# EAGLE design usbtinyisp (EAGLE 7.7.0)
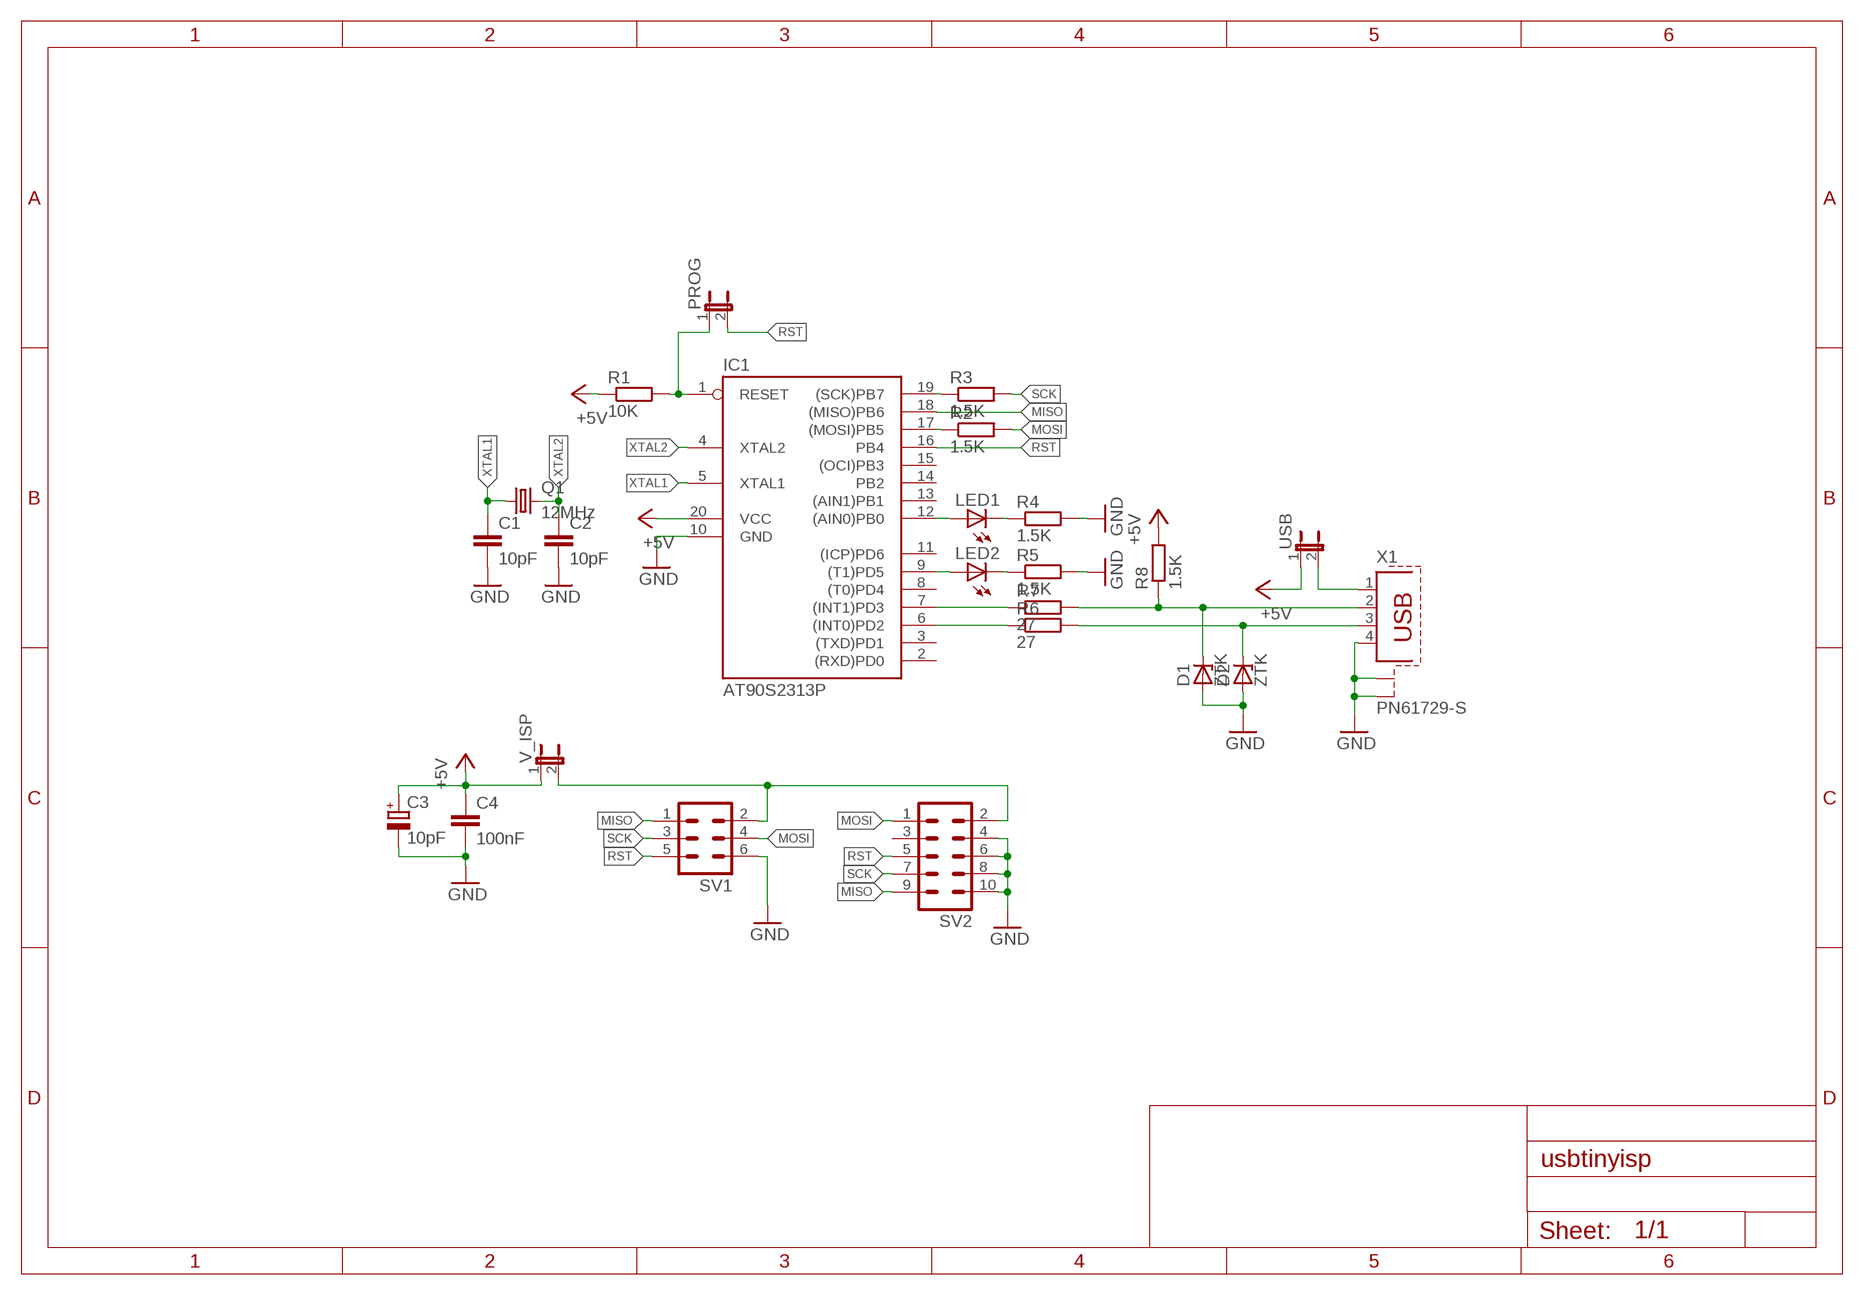
[diagram p0: schematic, sheet 1]

## Parts
C1  10pF  C-EU025-025X050  [C025-025X050]
C2  10pF  C-EU025-025X050  [C025-025X050]
C3  10pF  CPOL-EUE2,5-6E  [E2,5-6E]
C4  100nF  C-EU025-025X050  [C025-025X050]
D1  ZTK  [DO35Z10]
D2  ZTK  [DO35Z10]
IC1  AT90S2313P  [DIL20]
LED1  LED3MM  [LED3MM]
LED2  LED3MM  [LED3MM]
PROG  JP1E  [JP1]
Q1  12MHz  CRYSTALHC49U70  [HC49U70]
R1  10K  R-EU_0207/7  [0207/7]
R2  1.5K  R-EU_0207/7  [0207/7]
R3  1.5K  R-EU_0207/7  [0207/7]
R4  1.5K  R-EU_0207/7  [0207/7]
R5  1.5K  R-EU_0207/7  [0207/7]
R6  27  R-EU_0207/7  [0207/7]
R7  27  R-EU_0207/7  [0207/7]
R8  1.5K  R-EU_0207/7  [0207/7]
SV1  MA03-2  [MA03-2]
SV2  MA05-2  [MA05-2]
USB  JP1E  [JP1]
V_ISP  JP1E  [JP1]
X1  PN61729-S  [PN61729-S]

## Nets
+5V: C3.+ C4.1 IC1.20(VCC) R1.1 R8.2 USB.1 V_ISP.1
GND: C1.2 C2.2 C3.- C4.2 D1.A D2.A IC1.10(GND) R4.2 R5.2 SV1.6 SV2.4 SV2.6 SV2.8 SV2.10 X1.4 X1.S1 X1.S2
MISO: IC1.18((MISO)PB6) SV1.1 SV2.9
MOSI: R2.2 SV1.4 SV2.1
N$1: IC1.1(RESET) PROG.1 R1.2
N$2: IC1.12((AIN0)PB0) LED1.A
N$3: IC1.9((T1)PD5) LED2.A
N$4: LED1.K(C) R4.1
N$5: LED2.K(C) R5.1
N$6: IC1.7((INT1)PD3) R7.1
N$7: IC1.17((MOSI)PB5) R2.1
N$8: IC1.19((SCK)PB7) R3.1
N$9: IC1.6((INT0)PD2) R6.1
N$10: D2.C R6.2 X1.3
N$11: D1.C R7.2 R8.1 X1.2
N$13: USB.2 X1.1
N$14: SV1.2 SV2.2 V_ISP.2
RST: IC1.16(PB4) PROG.2 SV1.5 SV2.5
SCK: R3.2 SV1.3 SV2.7
XTAL1: C1.1 IC1.5(XTAL1) Q1.1
XTAL2: C2.1 IC1.4(XTAL2) Q1.2
Unconnected: IC1.2((RXD)PD0) IC1.3((TXD)PD1) IC1.8((T0)PD4) IC1.11((ICP)PD6) IC1.13((AIN1)PB1) IC1.14(PB2) IC1.15((OCI)PB3) SV2.3

## Library data of the parts
C1 C2 C4 = rcl:C-EU: CAPACITOR, European symbol
C3 = rcl:CPOL-EU: POLARIZED CAPACITOR, European symbol
D1 D2 = diode:ZTK: Z DIODE
IC1 = avr-5:AT90S2313: MICROCONTROLLER 2 Kbytes FLASH 128 bytes SRAM 128 bytes EEPROM UART
LED1 LED2 = led:LED: LED OSRAM: - CHIPLED LG R971, LG N971, LY N971, LG Q971, LY Q971, LO R971, LY R971 LH N974, LH R974 LS Q976, LO Q976, LY Q976 LO Q996 - Hyper CHIPLED LW Q18S LB Q993, LB Q99A, LB R99A - SideLED LS A670, LO A670, LY A670, LG A670, LP A670 LB A673, LV A673, LT A673, LW A673 LH A674 LY A675 LS A676, LA A676, LO A676, LY A676, LW A676 LS A679, LY A679, LG A679 - Hyper Micro SIDELED® LS Y876, LA Y876, LO Y876, LY Y876 LT Y87S - SmartLED LW L88C, LW L88S LB L89C, LB L89S, LG L890 LS L89K, LO L89K, LY L89K LS L896, LA L896, LO L896, LY L896 - TOPLED LS T670, LO T670, LY T670, LG T670, LP T670 LSG T670, LSP T670, LSY T670, LOP T670, LYG T670 LG T671, LOG T671, LSG T671 LB T673, LV T673, LT T673, LW T673 LH T674 LS T676, LA T676, LO T676, LY T676, LB T676, LH T676, LSB T676, LW T676 LB T67C, LV T67C, LT T67C, LS T67K, LO T67K, LY T67K, LW E67C LS E67B, LA E67B, LO E67B, LY E67B, LB E67C, LV E67C, LT E67C LW T67C LS T679, LY T679, LG T679 LS T770, LO T770, LY T770, LG T770, LP T770 LB T773, LV T773, LT T773, LW T773 LH T774 LS E675, LA E675, LY E675, LS T675 LS T776, LA T776, LO T776, LY T776, LB T776 LHGB T686 LT T68C, LB T68C - Hyper Mini TOPLED® LB M676 - Mini TOPLED Santana® LG M470 LS M47K, LO M47K, LY M47K Source: http://www.osram.convergy.de LUXEON: - LUMILED® LXK2-PW12-R00, LXK2-PW12-S00, LXK2-PW14-U00, LXK2-PW14-V00 LXK2-PM12-R00, LXK2-PM12-S00, LXK2-PM14-U00 LXK2-PE12-Q00, LXK2-PE12-R00, LXK2-PE12-S00, LXK2-PE14-T00, LXK2-PE14-U00 LXK2-PB12-K00, LXK2-PB12-L00, LXK2-PB12-M00, LXK2-PB14-N00, LXK2-PB14-P00, LXK2-PB14-Q00 LXK2-PR12-L00, LXK2-PR12-M00, LXK2-PR14-Q00, LXK2-PR14-R00 LXK2-PD12-Q00, LXK2-PD12-R00, LXK2-PD12-S00 LXK2-PH12-R00, LXK2-PH12-S00 LXK2-PL12-P00, LXK2-PL12-Q00, LXK2-PL12-R00 Source: www.luxeon.com KINGBRIGHT: KA-3528ASYC Source: www.kingbright.com
PROG USB V_ISP = jumper:JP1E: JUMPER
Q1 = crystal:CRYSTAL: CRYSTAL; OC_FARNELL: unknown; OC_NEWARK: unknown
R1-R8 = rcl:R-EU_: RESISTOR, European symbol
SV1 = con-lstb:MA03-2: PIN HEADER; OC_FARNELL: unknown; OC_NEWARK: unknown
SV2 = con-lstb:MA05-2: PIN HEADER; OC_FARNELL: unknown; OC_NEWARK: unknown
X1 = con-berg:PN61729-S: BERG USB connector; OC_FARNELL: unknown; OC_NEWARK: unknown

## Board
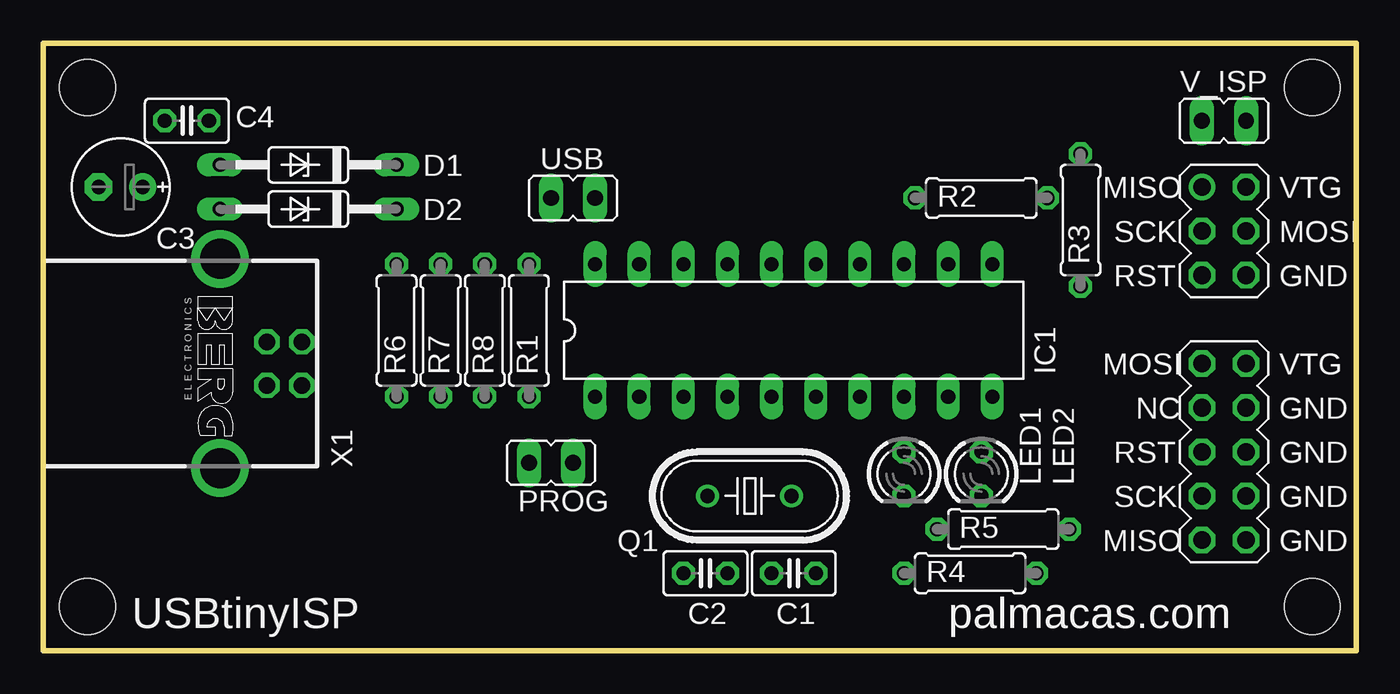
[diagram p1: board, top side]
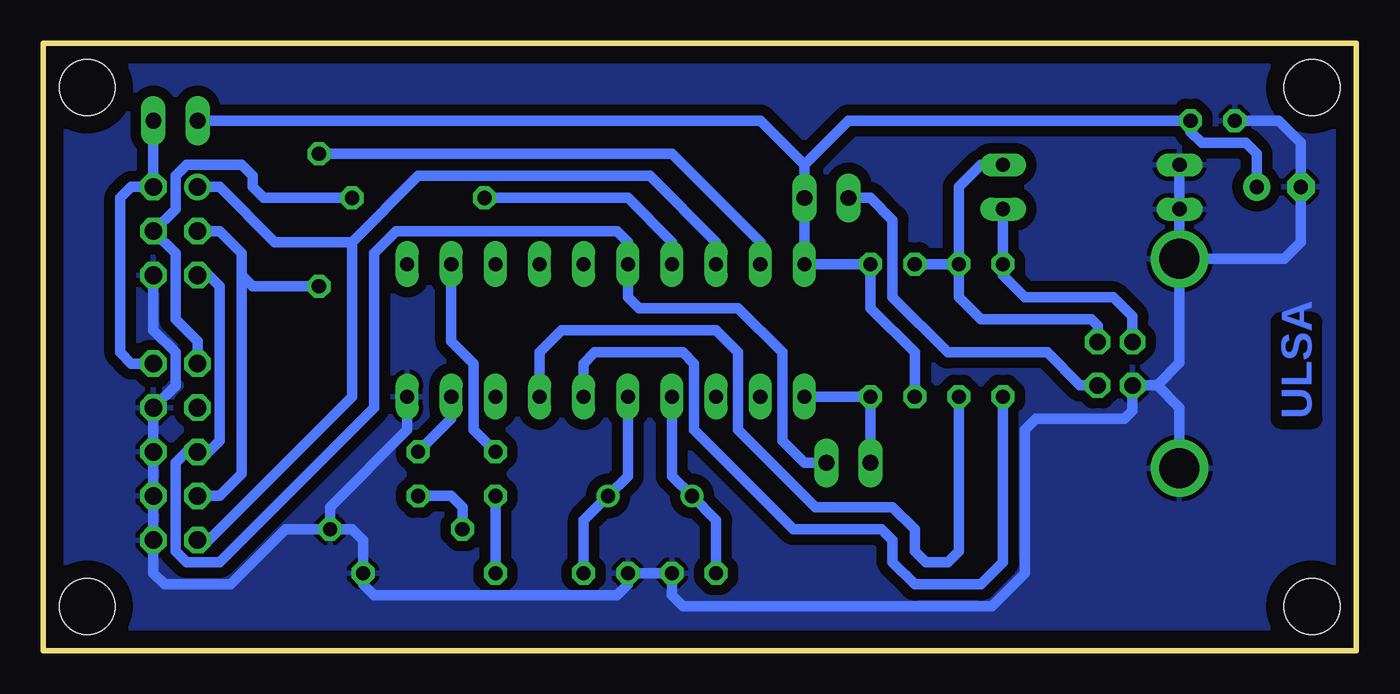
[diagram p2: board, bottom side, seen from below]

Size 75.55 x 34.92 mm. Coordinates in mm from the lower left corner, seen from the top.
Outline: 0,0 75.55,0 75.55,34.92 0,34.92 0,0
Copper layers (1*16): Top 0.035mm / dielectric 1.5mm / Bottom 0.035mm
Design rules "default": minimum track width 10mil, minimum drill 24mil, track to track 8mil, track to pad 8mil, pad to pad 8mil, via to via 8mil, smd to smd 8mil, copper to edge 40mil, drill to drill 8mil, minimum pad ring 10mil, minimum via ring 8mil, stop-mask expansion 4mil, vias tented up to drill 0mil, thermal gap 10mil
Holes 3.2 mm at 2.54,32.38 73.03,32.38 73.03,2.54 2.54,2.54

### Footprints (pad centres in the part's own frame; a part is rotated, then mirrored left to right if it is on the bottom)
C025-025X050 = drill 0.813 octagon: 1 -1.27,0; 2 1.27,0
E2,5-6E = drill 0.813 pad 1.575: + -1.27,0 | drill 0.813 pad 1.575 octagon: - 1.27,0
DO35Z10 = drill 0.813 long: A 5.08,0; C -5.08,0
DIL20 = drill 0.813 long: 1 -11.43,-3.81; 2 -8.89,-3.81; 3 -6.35,-3.81; 4 -3.81,-3.81; 5 -1.27,-3.81; 6 1.27,-3.81; 7 3.81,-3.81; 8 6.35,-3.81; 9 8.89,-3.81; 10 11.43,-3.81; 11 11.43,3.81; 12 8.89,3.81; 13 6.35,3.81; 14 3.81,3.81; 15 1.27,3.81; 16 -1.27,3.81; 17 -3.81,3.81; 18 -6.35,3.81; 19 -8.89,3.81; 20 -11.43,3.81
LED3MM = drill 0.813 octagon: A -1.27,0; K 1.27,0
JP1 = drill 0.914 long: 1 0,-1.27; 2 0,1.27
HC49U70 = drill 0.813: 1 -2.413,0; 2 2.413,0
0207/7 = drill 0.813 octagon: 1 -3.81,0; 2 3.81,0
MA03-2 = drill 1.016: 1 -2.54,-1.27 | drill 1.016 octagon: 2 -2.54,1.27; 3 0,-1.27; 4 0,1.27; 5 2.54,-1.27; 6 2.54,1.27
MA05-2 = drill 1.016 octagon: 1 -5.08,-1.27; 2 -5.08,1.27; 3 -2.54,-1.27; 4 -2.54,1.27; 5 0,-1.27; 6 0,1.27; 7 2.54,-1.27; 8 2.54,1.27; 9 5.08,-1.27; 10 5.08,1.27
PN61729-S = drill 0.95 octagon: 1 1.25,4.71; 2 -1.25,4.71; 3 -1.25,2.71; 4 1.25,2.71 | drill 2.3 pad 2.9: S1 -6.02,0; S2 6.02,0

### Placement (x,y rotation side)
C1  43.18,4.45 180 top
C2  38.1,4.45 0 top
C3  4.45,26.67 180 top
C4  8.26,30.48 180 top
D1  15.24,27.94 180 top
D2  15.24,25.4 180 top
IC1  43.18,18.41 0 top
LED1  49.53,10.16 270 top
LED2  53.98,10.16 270 top
PROG  29.21,10.79 270 top
Q1  40.64,8.89 180 top
R1  27.94,18.41 270 top
R2  53.98,26.04 0 top
R3  59.69,24.77 270 top
R4  53.34,4.45 0 top
R5  55.24,6.99 0 top
R6  20.32,18.41 90 top
R7  22.86,18.41 90 top
R8  25.4,18.41 270 top
SV1  67.94,24.13 270 top
SV2  67.94,11.43 270 top
USB  30.48,26.04 90 top
V_ISP  67.94,30.48 270 top
X1  10.16,16.51 270 top

### Tracks (layer width: path | path; a pad name or v marks a point on that pad's centre or on a via)
+5V
  Bottom 0.61: R8.2 25.4,17.14 27.94,19.68 R1.1 IC1.20 USB.1 31.75,27.94 | 31.75,27.94 29.21,30.48 C4.1 9.53,29.84 8.89,29.21 6.35,29.21 5.71,28.57 C3.+ | V_ISP.1 34.29,30.48 31.75,27.94
GND
  Bottom 0.61: 11.45,15.26 X1.4 12.87,13.8 13.34,13.34 18.41,13.34 19.05,12.7 19.05,4.45 20.95,2.54 38.73,2.54 39.37,3.17 C2.2 C1.2 41.91,3.81 42.55,3.17 56.52,3.17 57.15,3.81 R4.2 57.15,6.35 57.78,6.99 R5.2 | 11.45,15.26 10.16,13.97 X1.S2 | 11.45,15.26 10.16,16.55 X1.S1 | D1.A D2.A X1.S1 | SV1.6 69.22,18.41 67.94,17.14 67.94,15.24 SV2.4 SV2.6 SV2.8 SV2.10 69.22,4.45 68.58,3.81 64.77,3.81 61.59,6.99 R5.2 | X1.S1 4.14,22.53 3.17,23.5 C3.- 3.17,29.21 4.45,30.48 C4.2 | IC1.10 54.61,12.7 59.05,8.26 R5.2
  pour Bottom (isolate 0.61): 0,0 75.56,0 75.56,34.92 0,34.92
MISO
  Bottom 0.61: IC1.18 36.83,23.5 40.64,27.3 53.98,27.3 57.78,23.5 | SV2.9 66.04,6.35 57.78,14.61 57.78,23.5 | 57.78,23.5 62.23,23.5 65.41,26.67 SV1.1
MOSI
  Bottom 0.61: SV2.1 66.67,17.78 67.94,19.05 67.94,22.86 SV1.4 67.94,25.4 67.94,27.3 67.31,27.94 64.14,27.94 63.5,27.3 63.5,26.67 62.87,26.04 R2.2
N$1
  Bottom 0.61: IC1.1 R1.2 PROG.1
N$2
  Bottom 0.61: IC1.12 52.07,17.78 50.8,16.51 50.8,12.7 LED1.A
N$3
  Bottom 0.61: IC1.9 52.07,13.34 LED2.A
N$4
  Bottom 0.61: R4.1 LED1.K
N$5
  Bottom 0.61: R5.1 51.44,8.26 52.07,8.89 LED2.K
N$6
  Bottom 0.61: R7.1 22.86,5.71 23.5,5.08 24.77,5.08 25.4,5.71 25.4,6.99 26.67,8.26 31.11,8.26 35.56,12.7 35.56,17.14 36.83,18.41 45.72,18.41 46.99,17.14 IC1.7
N$7
  Bottom 0.61: IC1.17 39.37,23.5 41.91,26.04 R2.1
N$8
  Bottom 0.61: IC1.19 34.29,23.5 39.37,28.57 R3.1
N$9
  Bottom 0.61: R6.1 20.32,5.08 21.59,3.81 25.4,3.81 26.67,5.08 26.67,6.35 27.3,6.99 32.38,6.99 38.1,12.7 38.1,16.51 38.73,17.14 43.81,17.14 44.45,16.51 IC1.6
N$10
  Bottom 0.61: X1.3 12.87,19.22 13.97,20.32 19.05,20.32 20.32,21.59 R6.2 D2.C
N$11
  Bottom 0.61: R7.2 R8.1 | D1.C 21.59,27.94 22.86,26.67 R7.2 | X1.2 14.87,18.68 15.24,19.05 21.59,19.05 22.86,20.32 R7.2
N$13
  Bottom 0.61: X1.1 15.89,15.26 17.78,17.14 23.5,17.14 26.67,20.32 26.67,24.77 27.94,26.04 USB.2
N$14
  Bottom 0.61: SV2.2 70.48,16.51 71.12,17.14 71.12,26.04 70.48,26.67 SV1.2 V_ISP.2
RST
  Bottom 0.61: PROG.2 31.75,10.79 33.02,12.06 33.02,17.14 35.56,19.68 41.27,19.68 41.91,20.32 IC1.16 41.91,23.5 42.55,24.13 55.24,24.13 56.52,22.86 56.52,13.97 65.41,5.08 67.31,5.08 67.94,5.71 67.94,10.79 67.31,11.43 SV2.5 66.04,11.43 65.41,12.06 65.41,20.95 66.04,21.59 SV1.5
SCK
  Bottom 0.61: SV2.7 65.41,8.89 64.14,10.16 64.14,21.59 | 64.14,21.59 64.14,22.86 65.41,24.13 SV1.3 | R3.2 63.5,20.95 64.14,21.59
XTAL1
  Bottom 0.61: IC1.5 41.91,10.03 Q1.1 44.45,7.49 C1.1
XTAL2
  Bottom 0.61: IC1.4 39.37,10.03 Q1.2 36.83,7.49 C2.1

### Text on the board
Bottom: ULSA
tPlace: MISO | VTG | SCK | MOSI | RST | GND | MOSI | VTG | NC | GND | RST | GND | SCK | GND | MISO | GND | USBtinyISP | palmacas.com